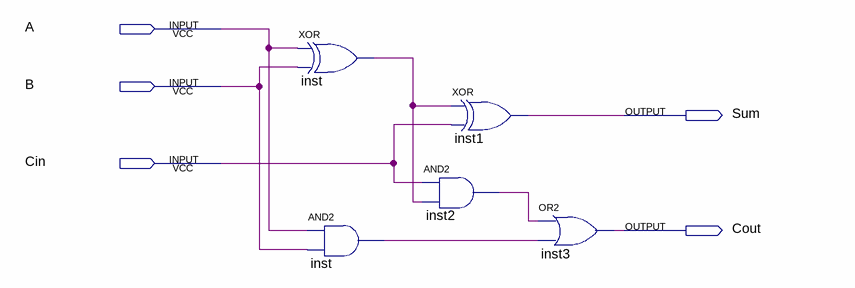
[diagram p0: schematic sheet]
// Quartus schematic funcl.bdf as structural Verilog: 5 symbols, 5 pins
module funcl (
  input  A,
  input  B,
  input  Cin,
  output Sum,
  output Cout
);

  wire inst2_out, inst_out, inst_out_2;

  xor inst (inst_out, A, B);
  and inst_dup2 (inst_out_2, A, B);
  xor inst1 (Sum, inst_out, Cin);
  and inst2 (inst2_out, Cin, inst_out);
  or inst3 (Cout, inst2_out, inst_out_2);
endmodule
